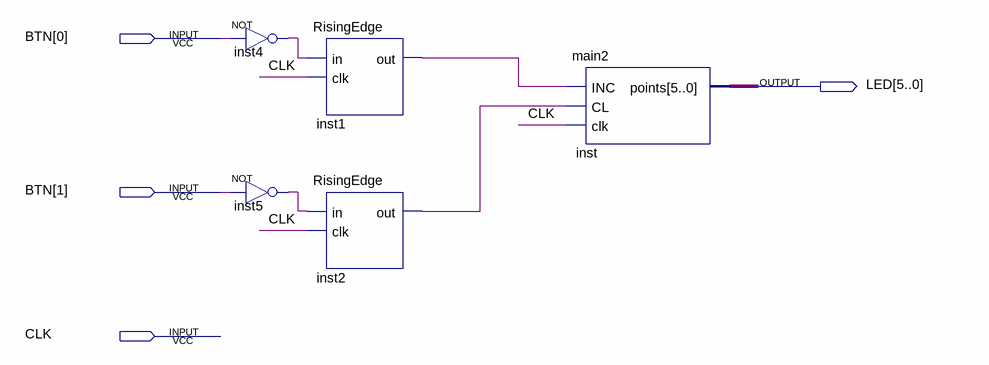
[diagram p0: schematic sheet]
// Quartus schematic test_main2.bdf as structural Verilog: 5 symbols, 4 pins
module test_main2 (
  input  [1:0] BTN,
  input  CLK,
  output [5:0] LED
);

  wire inst1_out, inst2_out, inst4_out, inst5_out;

  not inst4 (inst4_out, BTN[0]);
  not inst5 (inst5_out, BTN[1]);
  RisingEdge inst1 (.in(inst4_out), .clk(CLK), .out(inst1_out));
  RisingEdge inst2 (.in(inst5_out), .clk(CLK), .out(inst2_out));
  main2 inst (.INC(inst1_out), .CL(inst2_out), .clk(CLK), .points(LED));
endmodule
